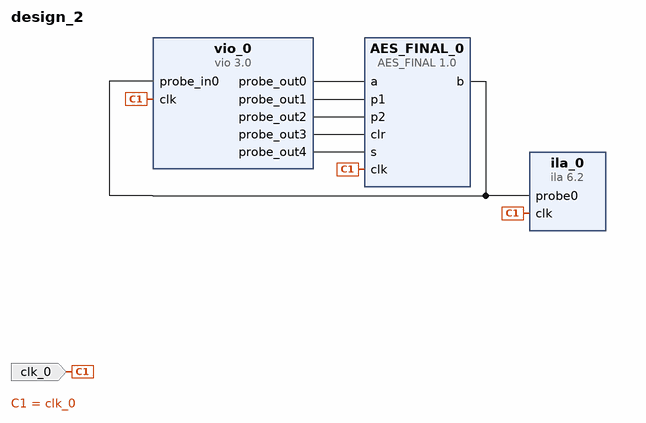
[diagram p0: block diagram of the top level]
# Vivado block design design_2, xc7k160tfbv484-1, Vivado 2017.4
create_bd_design design_2

create_bd_port -dir I -type clk clk_0

create_bd_cell -type ip -vlnv xilinx.com:user:AES_FINAL:1.0 AES_FINAL_0
create_bd_cell -type ip -vlnv xilinx.com:ip:vio:3.0 vio_0
set_property -dict [list \
  CONFIG.C_PROBE_OUT2_WIDTH 128 \
  CONFIG.C_PROBE_OUT1_WIDTH 128 \
  CONFIG.C_PROBE_OUT0_WIDTH 128 \
  CONFIG.C_NUM_PROBE_OUT 5 \
  CONFIG.C_EN_PROBE_IN_ACTIVITY 0 \
] [get_bd_cells vio_0]
create_bd_cell -type ip -vlnv xilinx.com:ip:ila:6.2 ila_0
set_property -dict [list \
  CONFIG.C_PROBE0_WIDTH 128 \
  CONFIG.C_NUM_OF_PROBES 1 \
  CONFIG.C_ENABLE_ILA_AXI_MON false \
  CONFIG.C_MONITOR_TYPE Native \
] [get_bd_cells ila_0]

# ---- connections ----

connect_bd_net [get_bd_pins AES_FINAL_0/b] [get_bd_pins vio_0/probe_in0] [get_bd_pins ila_0/probe0]
connect_bd_net [get_bd_pins vio_0/probe_out0] [get_bd_pins AES_FINAL_0/a]
connect_bd_net [get_bd_pins vio_0/probe_out1] [get_bd_pins AES_FINAL_0/p1]
connect_bd_net [get_bd_pins vio_0/probe_out2] [get_bd_pins AES_FINAL_0/p2]
connect_bd_net [get_bd_pins vio_0/probe_out3] [get_bd_pins AES_FINAL_0/clr]
connect_bd_net [get_bd_pins vio_0/probe_out4] [get_bd_pins AES_FINAL_0/s]
connect_bd_net -net clk_0_1 [get_bd_ports clk_0] [get_bd_pins vio_0/clk] [get_bd_pins AES_FINAL_0/clk] [get_bd_pins ila_0/clk]

validate_bd_design
save_bd_design
